# Altium schematic sheet Output Connections.SchDoc
size 420 x 297 mm; SheetNumber: 4; SheetTotal: 6
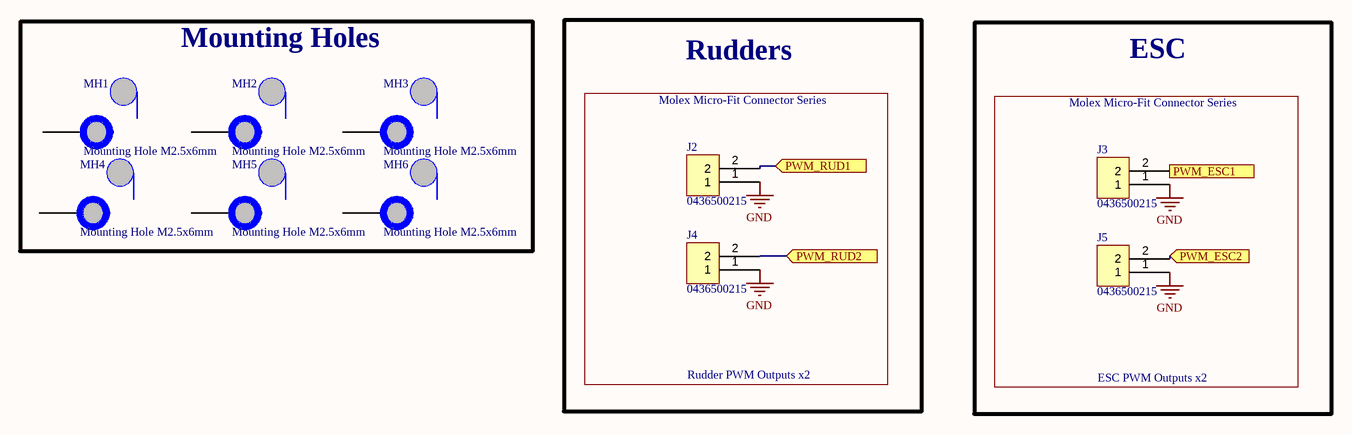
[diagram p0: Output Connections.SchDoc]

## Parts
J2  0436500215  [0436500215-Footprint-1]
J3  0436500215  [0436500215-Footprint-1]
J4  0436500215  [0436500215-Footprint-1]
J5  0436500215  [0436500215-Footprint-1]
MH1  Mounting Hole M2.5x6mm  [Mounting Hole M2.5x6mm-Footprint-1]
MH2  Mounting Hole M2.5x6mm  [Mounting Hole M2.5x6mm-Footprint-1]
MH3  Mounting Hole M2.5x6mm  [Mounting Hole M2.5x6mm-Footprint-1]
MH4  Mounting Hole M2.5x6mm  [Mounting Hole M2.5x6mm-Footprint-1]
MH5  Mounting Hole M2.5x6mm  [Mounting Hole M2.5x6mm-Footprint-1]
MH6  Mounting Hole M2.5x6mm  [Mounting Hole M2.5x6mm-Footprint-1]

## Blocks framed on the sheet
Mounting Holes: MH1-MH6
Rudders: J2 J4
ESC: J3 J5

## Ports
PWM_ESC1 (in), PWM_ESC2 (in), PWM_RUD1 (in), PWM_RUD2 (in)

## Nets
GND: J2.1 J3.1 J4.1 J5.1
PWM_ESC1: J3.2 ; port PWM_ESC1
PWM_ESC2: J5.2 ; port PWM_ESC2
PWM_RUD1: J2.2 ; port PWM_RUD1
PWM_RUD2: J4.2 ; port PWM_RUD2

Not connected (* = marked no-connect by the designer): MH1 0; MH2 0; MH3 0; MH4 0; MH5 0; MH6 0

## Notes on the sheet
- Molex Micro-Fit Connector Series
- Rudder PWM Outputs x2
- ESC PWM Outputs x2
- THIS DOCUMENT AND THE DATA DISCLOSED HEREIN OR
- HEREWITH IS THE PROPERTY OF ALTIUM LIMITED AND MAY
- DWG NO:
- REVISION
- REV:
- DESCRIPTION
- DATE
- APPROVED
- BE FREELY DISTRIBUTED IN WHOLE. NO RIGHTS ARE
- RESERVED OR EXPRESS OR IMPLIED WARANTEE GIVEN.
- ENG:
- APPROVALS
- PROJECT
- DSN:
- CHK:
- REFERENCE DOCUMENTS
- PROJECT REVISION:
- TITLE
- DOCUMENT REVISION:
- DESIGN ITEM:
- BOM:
- FAB DWG:
- PCB DWG:
- ASSY DWG:
- SCALE:
- A3
- SIZE
- CAGE CODE
- FILE NAME
- DWG NO.
- SHEET
- OF
- REV

## Library data of the parts
J2-J5 = CMP-00008-2: Header 1 Row Vertical Polarizing Peg 2 Pin SMT/Glow Wire Compatible Tin Plate; Number of Positions: 2; Max Voltage Rating (DC): 250V; Number of Ports: 1; Pitch: 3mm; Contact Resistance: 30mR; Connector Type: Male Pin; Mount: Through Hole; Depth: 5.57mm; Series: Micro-Fit 3.0™ 43650; Housing Material: Polymer; Max Operating Temperature: 105°C; Fastening Type: Ramp; Color: Black; Length: 9.65mm; Contact Plating: Tin; Number of Rows: 1; Housing Color: Black; RoHS Compliant: Yes; Orientation: Straight; Packaging: Tray; Number of Contacts: 2; Termination: Solder; Contact Material: Brass; Max Voltage Rating (AC): 250V; Min Operating Temperature: -40°C; Number of Terminals/Pins: 2; Contact Type: Male Pin
MH1-MH6 = CMP-00006-5: M2.5 Mounting Hole